# Altium schematic sheet Project_Information.SchDoc: =project_title
size Tabloid; CompanyName: Luxonis Holding; Organization: Luxonis Holding; Address1: 1925 Harmony Park Drive; Address2: Westminster, CO; Address3: 80234; Address4: United States; SheetNumber: 1; SheetTotal: 3
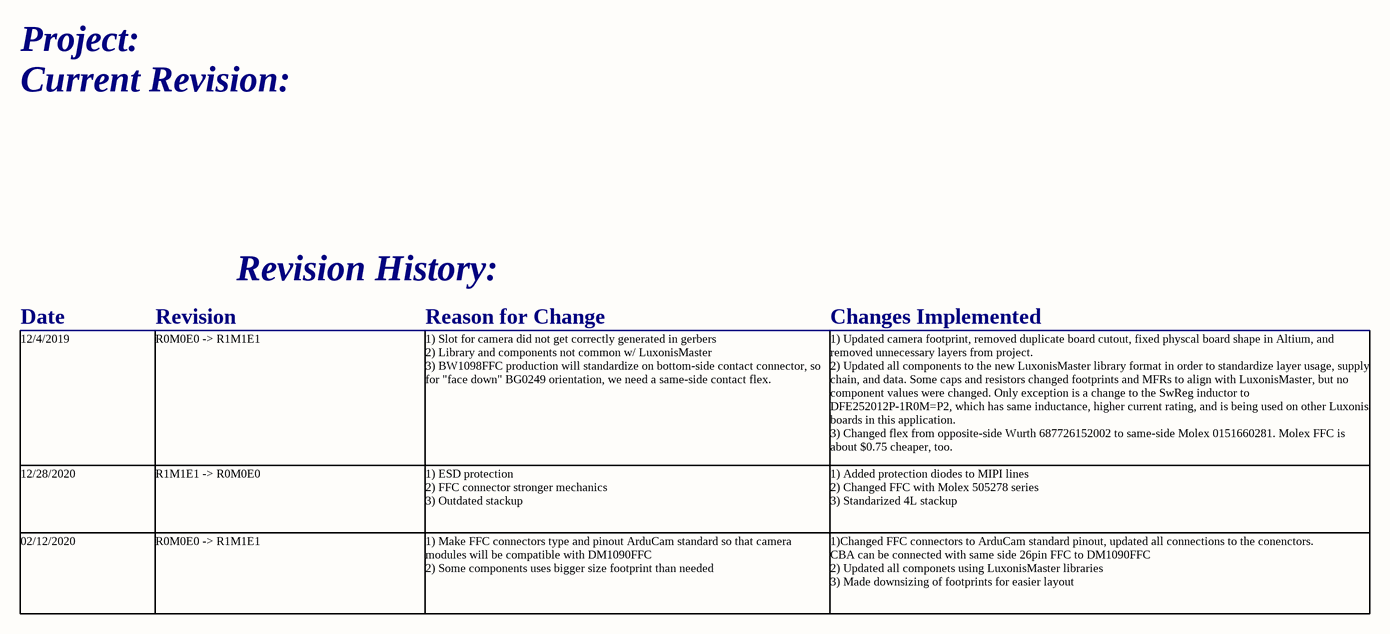
[diagram p0: Project_Information.SchDoc]

## Notes on the sheet
- Project:
- Current Revision:
- Revision History:
- Date
- Revision
- Reason for Change
- Changes Implemented
- 12/4/2019
- R0M0E0 -> R1M1E1
- 1) Slot for camera did not get correctly generated in gerbers
  2) Library and components not common w/ LuxonisMaster
  3) BW1098FFC production will standardize on bottom-side contact connector, so for "face down" BG0249 orientation, we need a same-side contact flex.
- 1) Updated camera footprint, removed duplicate board cutout, fixed physcal board shape in Altium, and removed unnecessary layers from project.
  2) Updated all components to the new LuxonisMaster library format in order to standardize layer usage, supply chain, and data. Some caps and resistors changed footprints and MFRs to align with LuxonisMaster, but no component values were changed. Only exception is a change to the SwReg inductor to DFE252012P-1R0M=P2, which has same inductance, higher current rating, and is being used on other Luxonis boards in this application.
  3) Changed flex from opposite-side Wurth 687726152002 to same-side Molex 0151660281. Molex FFC is about $0.75 cheaper, too.
- 12/28/2020
- R1M1E1 -> R0M0E0
- 1) ESD protection
  2) FFC connector stronger mechanics
  3) Outdated stackup
- 1) Added protection diodes to MIPI lines
  2) Changed FFC with Molex 505278 series
  3) Standarized 4L stackup
- 02/12/2020
- 1) Make FFC connectors type and pinout ArduCam standard so that camera modules will be compatible with DM1090FFC
  2) Some components uses bigger size footprint than needed
- 1)Changed FFC connectors to ArduCam standard pinout, updated all connections to the conenctors.
  CBA can be connected with same side 26pin FFC to DM1090FFC
  2) Updated all componets using LuxonisMaster libraries
  3) Made downsizing of footprints for easier layout
- Title
- Size:
- Date:
- Tabloid
- Number:
- Time:
- Revision:
- Sheet
- of
- Drawn by: